# EAGLE schematic BMS Microcontroller (EAGLE 7.2.0)
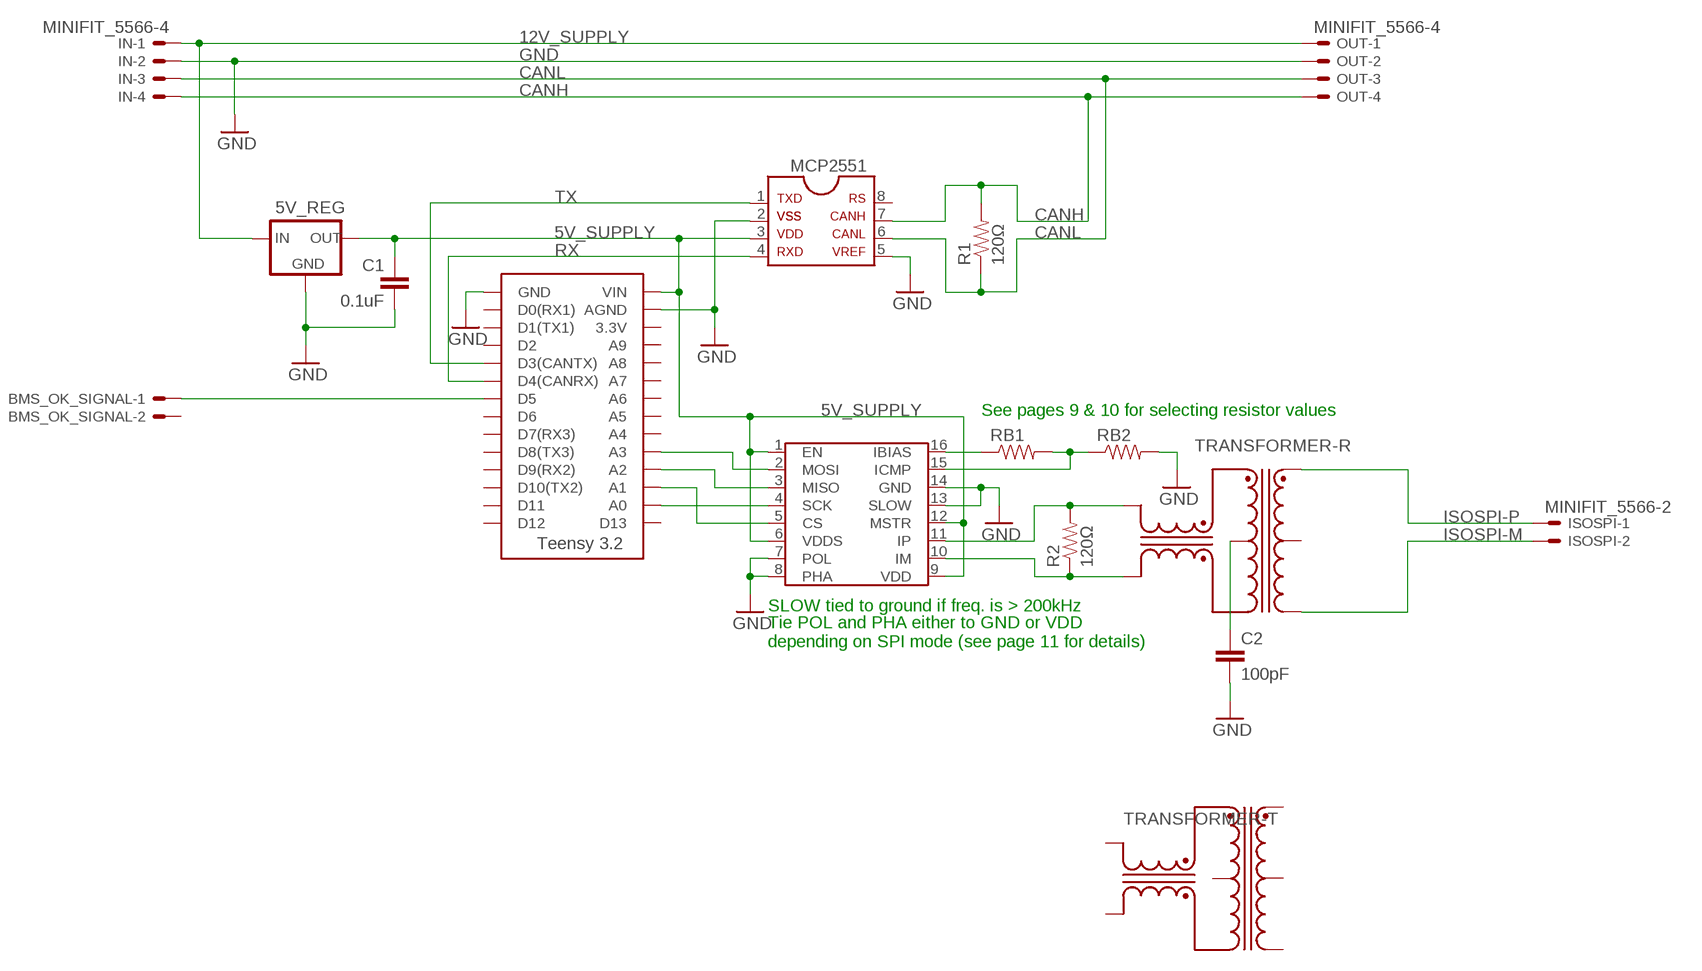
[diagram p0: schematic, sheet 1]

## Parts
5V_REG  5V_REGULATOR_LM340-NLM340MPX-5.0/NOPB  [SOT223]
BMS_OK_SIGNAL  MINIFIT_5566-2  [MINIFIT_5566-2]
C1  0.1uF  CAP0805  [0805]
C2  100pF  CAP0805  [0805]
IN  MINIFIT_5566-4  [MINIFIT_5566-4]
ISOSPI  MINIFIT_5566-2  [MINIFIT_5566-2]
MCP2551  MCP2551  [SOIC-08]
OUT  MINIFIT_5566-4  [MINIFIT_5566-4]
R1  120Ω  RESISTOR0805-RES  [0805]
R2  120Ω  RESISTOR0805-RES  [0805]
RB1  RESISTOR0805-RES  [0805]
RB2  RESISTOR0805-RES  [0805]
TRANSFORMER-  TRANSFORMER_749010013  [749010013]
U$1  LTC6820  [LTC6820]
U$3  TEENSY_3.2_SIMPLE  [TEENSY_3.2_SIMPLE]

## Nets
5V_SUPPLY: 5V_REG.3(OUT) C1.1 MCP2551.3 U$1.1(EN) U$1.6(VDDS) U$1.9(VDD) U$1.12(MSTR) U$3.VIN
12V_SUPPLY: 5V_REG.1(IN) IN.1 OUT.1
CANH: IN.4 MCP2551.7 OUT.4 R1.2
CANL: IN.3 MCP2551.6 OUT.3 R1.1
GND: 5V_REG.2(GND) 5V_REG.4(GND) C1.2 C2.2 IN.2 MCP2551.2 MCP2551.5 OUT.2 RB2.2 U$1.7(POL) U$1.8(PHA) U$1.13(SLOW) U$1.14(GND) U$3.AGND U$3.GND
ISOSPI-M: ISOSPI.2 TRANSFORMER-.8(R:D-)
ISOSPI-P: ISOSPI.1 TRANSFORMER-.6(R:D+)
N$1: U$1.5(CS) U$3.A1
N$2: U$1.4(SCK) U$3.A0
N$3: U$1.3(MISO) U$3.A2
N$4: U$1.2(MOSI) U$3.A3
N$5: C2.1 TRANSFORMER-.10(R:CX)
N$6: RB1.1 U$1.16(IBIAS)
N$7: RB1.2 RB2.1 U$1.15(ICMP)
N$8: R2.2 TRANSFORMER-.11(R:X+) U$1.11(IP)
N$9: R2.1 TRANSFORMER-.9(R:X-) U$1.10(IM)
N$10: BMS_OK_SIGNAL.1 U$3.D5
RX: MCP2551.4 U$3.D4(CANRX)
TX: MCP2551.1 U$3.D3(CANTX)
Unconnected: BMS_OK_SIGNAL.2 MCP2551.8 TRANSFORMER-.1(T:D+) TRANSFORMER-.2(T:CD) TRANSFORMER-.3(T:D-) TRANSFORMER-.7(R:CD) TRANSFORMER-.14(T:X-) TRANSFORMER-.15(T:CX) TRANSFORMER-.16(T:X+) U$3.3.3V U$3.A4 U$3.A5 U$3.A6 U$3.A7 U$3.A8 U$3.A9 U$3.D0(RX1) U$3.D1(TX1) U$3.D2 U$3.D6 U$3.D7(RX3) U$3.D8(TX3) U$3.D9(RX2) U$3.D10(TX2) U$3.D11 U$3.D12 U$3.D13

## Notes on the sheet
- See pages 9 & 10 for selecting resistor values
- SLOW tied to ground if freq. is > 200kHz
- Tie POL and PHA either to GND or VDD
  depending on SPI mode (see page 11 for details)

## Library data of the parts
5V_REG = HyTechDevices:5V_REGULATOR_LM340-N: Voltage Regulator 5v linear voltage regulator Datasheet <http://www.mouser.com/ProductDetail/Texas-Instruments/LM340MPX-50-NOPB/?qs=X1J7HmVL2ZGZwtTFRQ9ItA%3D%3D> MAX current out: 1.5A MAX voltage in: 35V
BMS_OK_SIGNAL ISOSPI = HyTechDevices:MINIFIT_5566-2: Mini-Fit Junior connector 2 pole Source: http://www.molex.com; OC_FARNELL: 1822072; OC_NEWARK: unknown
C1 C2 = HyTechDevices:CAP: Capacitor Standard 0603 ceramic capacitor, and 0.1" leaded capacitor.
IN OUT = HyTechDevices:MINIFIT_5566-4: Mini-Fit Junior connector 4 pole Source: http://www.molex.com; OC_FARNELL: unknown; OC_NEWARK: unknown
MCP2551 = HyTechDevices:MCP2551: MCP2551 High-Speed CAN Transceiver Product Webpage <https://www.microchip.com/wwwproducts/en/MCP2551> Datasheet <http://ww1.microchip.com/downloads/en/DeviceDoc/21667f.pdf> This device is outdated It is replaced by MCP2561. Comparison Page <https://www.microchip.com/wwwproducts/ProductCompare/MCP2551/MCP2561> Product Webpage <https://www.microchip.com/wwwproducts/en/MCP2561> Datasheet <http://ww1.microchip.com/downloads/en/DeviceDoc/20005167C.pdf>
R1 R2 RB1 RB2 = HyTechDevices:RESISTOR: Resistor Basic schematic elements and footprints for 0603, 1206, and PTH resistors.
TRANSFORMER- = HyTechDevices:TRANSFORMER_749010013: Wurth Electronics Midcom 749010013 10/100BaseTX Ethernet Transformer Datasheet <http://www.mouser.com/ds/2/445/749010013-311000.pdf> Mouser Page <http://www.mouser.com/ProductDetail/Wurth-Electronics-Midcom/749010013/?qs=40TFAHZMFvcjCZphxWYgVw%3D%3D>
U$1 = HyTechDevices:LTC6820: Linear Technology LTC6820 isoSPI Isolated Communications Interface Datasheet <http://cds.linear.com/docs/en/datasheet/6820fa.pdf>
U$3 = HyTechDevices:TEENSY_3.2_SIMPLE: Simple version of the Teensy 3.2 board that only uses the 2 main rows of pins, not the inner pins or the pins opposite the usb port.